# EAGLE design piglow (EAGLE 6.4)
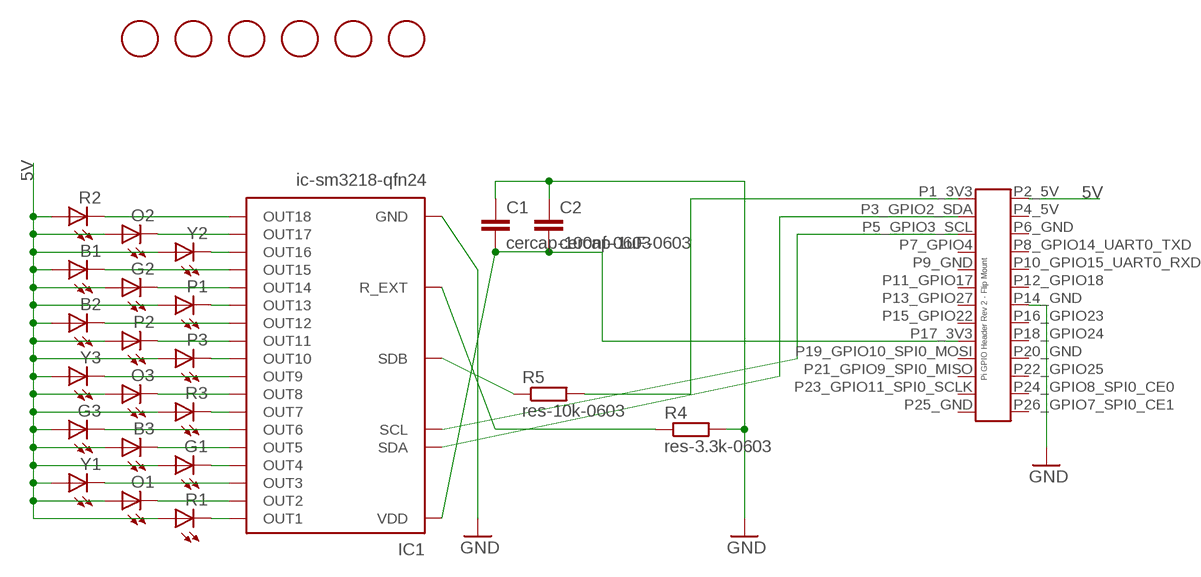
[diagram p0: schematic, sheet 1]

## Parts
B1  led-blue-0805  LEDCHIPLED_0805  [CHIPLED_0805]
B2  led-blue-0805  LEDCHIPLED_0805  [CHIPLED_0805]
B3  led-blue-0805  LEDCHIPLED_0805  [CHIPLED_0805]
C1  cercap-100nf-0603  C-EUC0603K  [C0603K]
C2  cercap-1uF-0603  C-EUC0603K  [C0603K]
G1  led-green-0805  LEDCHIPLED_0805  [CHIPLED_0805]
G2  led-green-0805  LEDCHIPLED_0805  [CHIPLED_0805]
G3  led-green-0805  LEDCHIPLED_0805  [CHIPLED_0805]
IC1  ic-sm3218-qfn24  SN3218  [QFN24]
O1  led-orange-0805  LEDCHIPLED_0805  [CHIPLED_0805]
O2  led-orange-0805  LEDCHIPLED_0805  [CHIPLED_0805]
O3  led-orange-0805  LEDCHIPLED_0805  [CHIPLED_0805]
P1  led-pink-0805  LEDCHIPLED_0805  [CHIPLED_0805]
P2  led-pink-0805  LEDCHIPLED_0805  [CHIPLED_0805]
P3  led-pink-0805  LEDCHIPLED_0805  [CHIPLED_0805]
R1  led-red-0805  LEDCHIPLED_0805  [CHIPLED_0805]
R2  led-red-0805  LEDCHIPLED_0805  [CHIPLED_0805]
R3  led-red-0805  LEDCHIPLED_0805  [CHIPLED_0805]
R4  res-3.3k-0603  R-EU_R0603  [R0603]
R5  res-10k-0603  R-EU_R0603  [R0603@1]
U$1  FIDUCIAL  [FIDUCIAL_1MM]
U$2  FIDUCIAL  [FIDUCIAL_1MM]
U$3  FIDUCIAL  [FIDUCIAL_1MM]
U$4  FCI_89898_313LF_26P_CONNECTOR_SMT_FLIPPED  [FCI_89898_313LF_26P_CONNECTOR_SMT_FLIPPED]
U$5  FIDUCIAL  [FIDUCIAL_1MM]
U$6  FIDUCIAL  [FIDUCIAL_1MM]
U$7  FIDUCIAL  [FIDUCIAL_1MM]
Y1  led-yellow-0805  LEDCHIPLED_0805  [CHIPLED_0805]
Y2  led-yellow-0805  LEDCHIPLED_0805  [CHIPLED_0805]
Y3  led-yellow-0805  LEDCHIPLED_0805  [CHIPLED_0805]

## Nets
5V: B1.A B2.A B3.A G1.A G2.A G3.A O1.A O2.A O3.A P1.A P2.A P3.A R1.A R2.A R3.A U$4.P2_5V Y1.A Y2.A Y3.A
GND: C1.1 C2.1 IC1.4(GND) IC1.GND R4.2 U$4.P14_GND
N$1: IC1.6(SCL) U$4.P5_GPIO3_SCL
N$2: IC1.5(SDA) U$4.P3_GPIO2_SDA
N$3: IC1.24(SDB) R5.1
N$4: IC1.1(OUT18) R2.C
N$5: IC1.23(OUT17) O2.C
N$6: IC1.22(OUT16) Y2.C
N$7: B1.C IC1.21(OUT15)
N$8: IC1.7(OUT1) R1.C
N$9: IC1.8(OUT2) O1.C
N$10: IC1.9(OUT3) Y1.C
N$11: G1.C IC1.10(OUT4)
N$12: B3.C IC1.11(OUT5)
N$13: G3.C IC1.12(OUT6)
N$14: IC1.13(OUT7) R3.C
N$15: IC1.14(OUT8) O3.C
N$16: IC1.15(OUT9) Y3.C
N$17: IC1.16(OUT10) P3.C
N$18: IC1.17(OUT11) P2.C
N$19: IC1.2(R_EXT) R4.1
N$20: IC1.19(OUT13) P1.C
N$21: B2.C IC1.18(OUT12)
N$22: G2.C IC1.20(OUT14)
N$23: C1.2 C2.2 IC1.3(VDD) U$4.P17_3V3
VCC: R5.2 U$4.P1_3V3
Unconnected: U$4.P6_GND U$4.P7_GPIO4 U$4.P8_GPIO14_UART0_TXD U$4.P9_GND U$4.P10_GPIO15_UART0_RXD U$4.P11_GPIO17 U$4.P12_GPIO18 U$4.P13_GPIO27 U$4.P15_GPIO22 U$4.P16_GPIO23 U$4.P18_GPIO24 U$4.P19_GPIO10_SPI0_MOSI U$4.P20_GND U$4.P21_GPIO9_SPI0_MISO U$4.P22_GPIO25 U$4.P23_GPIO11_SPI0_SCLK U$4.P24_GPIO8_SPI0_CE0 U$4.P25_GND U$4.P26_GPIO7_SPI0_CE1

## Power pins joined to a net without a drawn wire
P4_5V: U$4.P4_5V

## Library data of the parts
B1-B3 G1-G3 O1-O3 P1-P3 R1-R3 Y1-Y3 = adafruit:LED: LED OSRAM: - CHIPLED LG R971, LG N971, LY N971, LG Q971, LY Q971, LO R971, LY R971 LH N974, LH R974 LS Q976, LO Q976, LY Q976 LO Q996 - Hyper CHIPLED LW Q18S LB Q993, LB Q99A, LB R99A - SideLED LS A670, LO A670, LY A670, LG A670, LP A670 LB A673, LV A673, LT A673, LW A673 LH A674 LY A675 LS A676, LA A676, LO A676, LY A676, LW A676 LS A679, LY A679, LG A679 - Hyper Micro SIDELED® LS Y876, LA Y876, LO Y876, LY Y876 LT Y87S - SmartLED LW L88C, LW L88S LB L89C, LB L89S, LG L890 LS L89K, LO L89K, LY L89K LS L896, LA L896, LO L896, LY L896 - TOPLED LS T670, LO T670, LY T670, LG T670, LP T670 LSG T670, LSP T670, LSY T670, LOP T670, LYG T670 LG T671, LOG T671, LSG T671 LB T673, LV T673, LT T673, LW T673 LH T674 LS T676, LA T676, LO T676, LY T676, LB T676, LH T676, LSB T676, LW T676 LB T67C, LV T67C, LT T67C, LS T67K, LO T67K, LY T67K, LW E67C LS E67B, LA E67B, LO E67B, LY E67B, LB E67C, LV E67C, LT E67C LW T67C LS T679, LY T679, LG T679 LS T770, LO T770, LY T770, LG T770, LP T770 LB T773, LV T773, LT T773, LW T773 LH T774 LS E675, LA E675, LY E675, LS T675 LS T776, LA T776, LO T776, LY T776, LB T776 LHGB T686 LT T68C, LB T68C - Hyper Mini TOPLED® LB M676 - Mini TOPLED Santana® LG M470 LS M47K, LO M47K, LY M47K Source: http://www.osram.convergy.de/
C1 C2 = resistor:C-EU: CAPACITOR, European symbol
IC1 = pimoroni:SN3218: SN3218 16-channel LED driver
R4 = rcl:R-EU_: RESISTOR, European symbol
R5 = resistor:R-EU_: RESISTOR, European symbol
U$1-U$3 U$5-U$7 = adafruit:FIDUCIAL: For use by pick and place machines to calibrate the vision/machine, 1mm By microbuilder.eu
U$4 = pimoroni:FCI_89898_313LF_26P_CONNECTOR_SMT_FLIPPED

## Board
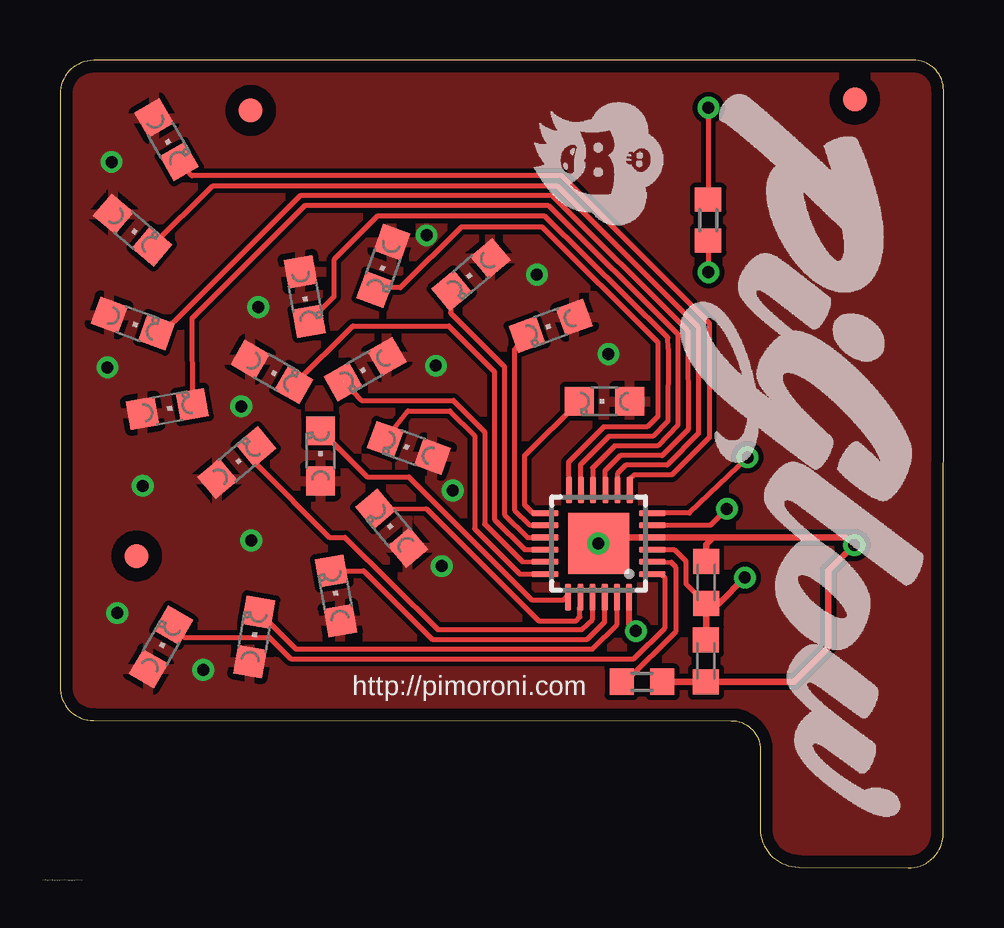
[diagram p1: board, top side]
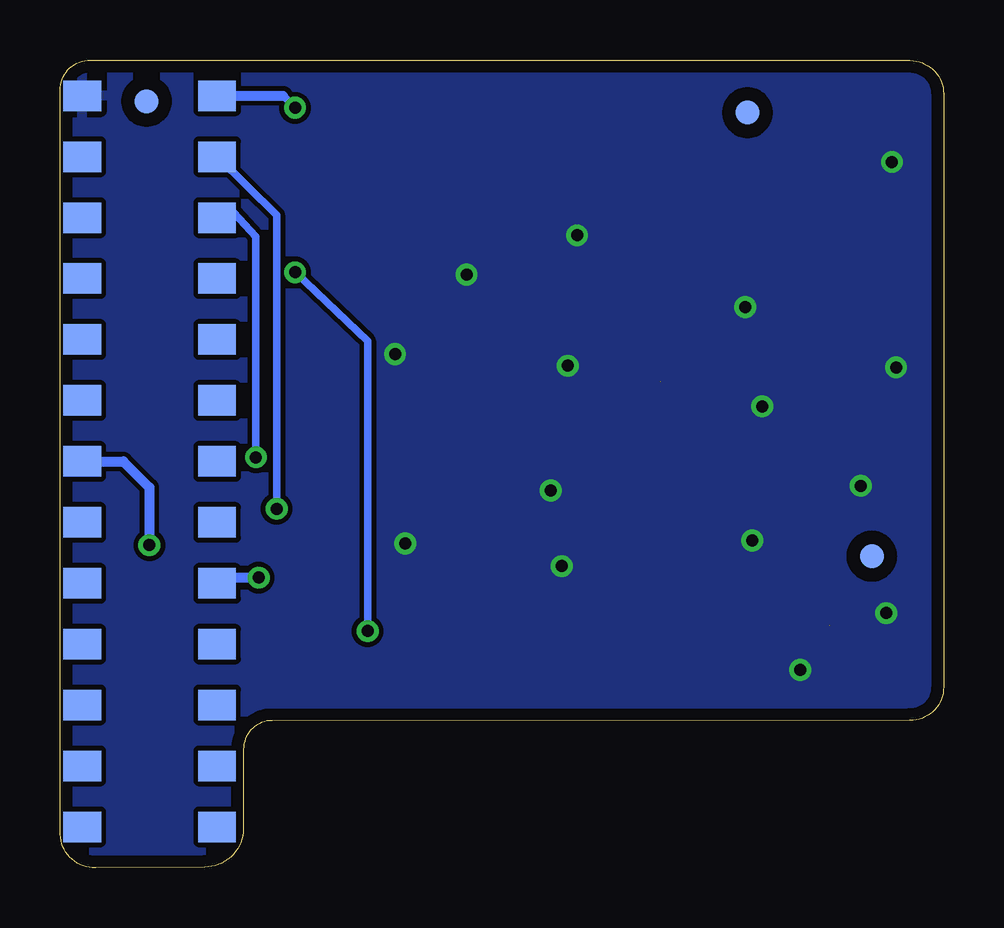
[diagram p2: board, bottom side, seen from below]

Size 36.82 x 33.68 mm. Coordinates in mm from the lower left corner, seen from the top.
Outline: 0,32.26 0,7.54 arc90 1.4,6.14 27.97,6.14 arc-90 29.17,4.94 29.17,1.63 arc90 30.79,0.03 35.33,0 arc90 36.8,1.4 36.82,32.41 arc90 35.54,33.68 1.4,33.66 arc90 0,32.26
Copper layers (1*16): Top 0.035mm / dielectric 1.5mm / Bottom 0.035mm
Design rules "default *": minimum track width 10mil, minimum drill 24mil, track to track 8mil, track to pad 8mil, pad to pad 8mil, via to via 8mil, smd to smd 8mil, copper to edge 20mil, drill to drill 8mil, minimum pad ring 10mil, minimum via ring 8mil, stop-mask expansion 4mil, vias tented up to drill 25mil, thermal gap 10mil

### Footprints (pad centres in the part's own frame; a part is rotated, then mirrored left to right if it is on the bottom)
CHIPLED_0805 = smd 1.2 x 1.2: A 0,-1.05; C 0,1.05
C0603K = smd 1.05 x 1.08: 1 -0.875,0; 2 0.875,0
QFN24 = smd 1.108 x 0.254: 1 -2.235,1.27; 2 -2.235,0.762; 3 -2.235,0.254; 4 -2.235,-0.254; 5 -2.235,-0.762; 6 -2.235,-1.27; 13 2.235,-1.27; 14 2.235,-0.762; 15 2.235,-0.254; 16 2.235,0.254; 17 2.235,0.762; 18 2.235,1.27 | smd 0.254 x 1.108: 7 -1.295,-2.235; 8 -0.787,-2.235; 9 -0.279,-2.235; 10 0.229,-2.235; 11 0.737,-2.235; 12 1.245,-2.235; 19 1.27,2.235; 20 0.762,2.235; 21 0.254,2.235; 22 -0.254,2.235; 23 -0.762,2.235; 24 -1.27,2.235 | smd 2.54 x 2.54: GND 0,0
R0603 = smd 1 x 1.1: 1 -0.85,0; 2 0.85,0
FIDUCIAL_1MM = smd 1 x 1: 1 0,0
FCI_89898_313LF_26P_CONNECTOR_SMT_FLIPPED = smd 1.27 x 1.57: P1_3V3 15.24,-2.81; P2_5V 15.24,2.81; P3_GPIO2_SDA 12.7,-2.81; P4_5V 12.7,2.81; P5_GPIO3_SCL 10.16,-2.81; P6_GND 10.16,2.81; P7_GPIO4 7.62,-2.81; P8_GPIO14_UART0_TXD 7.62,2.81; P9_GND 5.08,-2.81; P10_GPIO15_UART0_RXD 5.08,2.81; P11_GPIO17 2.54,-2.81; P12_GPIO18 2.54,2.81; P13_GPIO27 0,-2.81; P14_GND 0,2.81; P15_GPIO22 -2.54,-2.81; P16_GPIO23 -2.54,2.81; P17_3V3 -5.08,-2.81; P18_GPIO24 -5.08,2.81; P19_GPIO10_SPI0_MOSI -7.62,-2.81; P20_GND -7.62,2.81; P21_GPIO9_SPI0_MISO -10.16,-2.81; P22_GPIO25 -10.16,2.81; P23_GPIO11_SPI0_SCLK -12.7,-2.81; P24_GPIO8_SPI0_CE0 -12.7,2.81; P25_GND -15.24,-2.81; P26_GPIO7_SPI0_CE1 -15.24,2.81

### Placement (x,y rotation side)
B1  7.36,16.89 310 top
B2  14.53,17.51 70 top
B3  10.2,23.82 190 top
C1  26.91,8.63 90 top
C2  26.93,11.9 270 top
G1  4.48,19.13 280 top
G2  13.82,14.16 40 top
G3  13.47,25.09 160 top
IC1  22.44,13.52 180 top
O1  3.02,26.59 230 top
O2  8.09,9.63 350 top
O3  20.44,22.59 110 top
P1  10.86,17.17 0 top
P2  12.71,20.79 120 top
P3  8.83,20.67 240 top
R1  4.44,30.35 210 top
R2  4.21,9.2 330 top
R3  22.69,19.45 90 top
R4  24.25,7.76 0 top
R5  res-10k-0603  [R0603]  27.01,27 90 top
U$1  3.2,13 0 top
U$2  33.21,31.96 0 bottom
U$3  7.95,31.57 0 top
U$4  33.08,16.95 90 bottom
U$5  8.17,31.48 0 bottom
U$6  2.99,12.99 0 bottom
U$7  33.12,32.04 0 top
Y1  3.03,22.69 250 top
Y2  11.5,11.34 10 top
Y3  17.13,24.74 130 top

### Tracks (layer width: path | path; a pad name or v marks a point on that pad's centre or on a via)
5V  (via drill 0.5)
  other vias: 22.85,21.42 8.26,23.38 1.98,20.86 2.39,10.62 3.45,15.93 7.97,13.64 16.37,15.73 19.87,24.73 15.27,26.37 15.66,20.93 2.15,29.43 15.91,12.58 7.55,19.24 5.97,8.25 22.43,13.53
  pour Top: 0.2,33.62 0.17,6.23 28.79,5.9 29.16,0.29 36.98,0.2 36.9,33.79
  pour Bottom: 0.17,33.48 0.22,6.28 28.8,6.01 29.18,0.37 37.03,0.12 36.87,33.78 0.63,33.56
GND  (via drill 0.5)
  Top 0.203: 22.7,13.77 arc90 IC1.GND
  Top 0.279: R4.2 C1.1 30.57,7.75 32.01,9.19 32.01,12.39 v33.09,13.45 32.74,13.77 27.22,13.77 | 27.22,13.77 IC1.4 22.7,13.77 | C2.1 26.93,13.48 27.22,13.77
  Bottom 0.406: U$4.P14_GND 34.18,16.94 33.09,15.86 33.09,14.41 v33.09,13.45
N$1  (via drill 0.5)
  Top 0.203: v28.65,17.12 26.22,14.79 IC1.6
  Bottom 0.305: U$4.P5_GPIO3_SCL 29.58,27.31 28.65,26.32 v28.65,17.12
N$2  (via drill 0.5)
  Top 0.203: v27.79,14.97 27.1,14.28 IC1.5
  Bottom 0.305: U$4.P3_GPIO2_SDA 27.79,27.22 v27.79,14.97
N$3  (via drill 0.5)
  Top 0.203: R5.1 v27.02,24.83
  Top 0.254: v24,9.87 23.72,10.15 IC1.24
  Bottom 0.305: v27.02,24.83 24,21.96 v24,9.87
N$4  (1 unrouted)
  Top 0.203: R2.C 5.15,9.61 8.72,9.61 9.62,8.71 23.91,8.71 25.22,10.01 25.22,12.07 25.01,12.24 IC1.1
N$5
  Top 0.203: O2.C 9.82,9.12 22.18,9.12 23.21,10.15 IC1.23
N$6
  Top 0.203: Y2.C 12.66,12.38 15.5,9.53 21.96,9.53 22.69,10.25 IC1.22
N$7
  Top 0.203: B1.C 8.19,16.83 11.22,13.78 11.87,13.78 15.73,9.93 21.75,9.93 22.19,10.36 IC1.21
N$8
  Top 0.203: R1.C 5.5,28.85 20.9,28.85 27.06,22.7 27.06,17.93 25.5,16.38 23.93,16.38 23.72,16.19 IC1.7
N$9
  Top 0.203: O1.C 6.37,28.44 20.71,28.44 26.6,22.54 26.6,18.1 25.29,16.79 23.58,16.79 23.22,16.43 IC1.8
N$10
  Top 0.203: Y1.C 4.76,22.77 10,28.02 20.52,28.02 26.16,22.39 26.17,18.26 25.09,17.18 23.35,17.18 22.7,16.55 IC1.9
N$11
  Top 0.203: G1.C 5.5,22.91 10.19,27.6 20.36,27.6 25.75,22.25 25.75,18.47 24.9,17.59 23.11,17.59 22.19,16.68 IC1.10
N$12
  Top 0.203: B3.C 11.41,23.81 11.41,25.35 13.22,27.17 20.21,27.17 25.33,22.1 25.33,21.66 25.33,18.62 24.7,17.98 22.87,17.98 21.69,16.8 IC1.11
N$13
  Top 0.203: G3.C 13.14,24.18 14.18,24.18 16.73,26.72 20.08,26.72 24.92,21.91 24.91,18.82 24.47,18.38 22.65,18.38 21.18,16.9 IC1.12
N$14
  Top 0.203: R3.C 19.35,17.17 19.35,15.14 19.7,14.8 20.2,14.78 IC1.13
N$15
  Top 0.203: O3.C 18.93,21.62 18.93,14.92 19.58,14.29 IC1.14
N$16
  Top 0.203: Y3.C 16.28,23.13 18.51,20.89 18.51,14.73 19.49,13.77 IC1.15
N$17
  Top 0.203: P3.C 12.2,22.59 16.2,22.59 18.1,20.69 18.1,14.53 19.36,13.27 IC1.16
N$18  (1 unrouted)
  Top 0.203: P2.C 12.55,19.48 16.39,19.48 17.7,18.17 17.7,14.33 19.26,12.76 IC1.17
N$19
  Top 0.203: IC1.2 25.47,12.74 25.65,12.54 25.65,9.84 23.59,7.79 23.49,7.86 R4.1
N$20
  Top 0.203: P1.C 12.8,16.29 14.54,16.29 19.65,11.18 21,11.18 21.18,11.37 IC1.19
N$21
  Top 0.203: B2.C 14.5,19.05 16.25,19.05 17.28,18.02 17.28,14.14 19.16,12.24 IC1.18
N$22
  Top 0.203: G2.C 15.26,14.97 19.95,10.3 21.52,10.3 21.66,10.45 IC1.20
N$23  (via drill 0.5)
  Top 0.203: IC1.3 25.58,13.27 26.08,12.79 26.08,11.85 C2.2 | C1.2 arc90 26.93,9.52
  Top 0.279: 26.93,9.52 C2.2 27.46,11.02 v28.54,12.1
  Bottom 0.406: U$4.P17_3V3 30.29,12.1 v28.54,12.1
VCC  (via drill 0.5)
  Top 0.203: v27.02,31.69 27.02,27.86 R5.2
  Bottom 0.305: 27.52,32.18 v27.02,31.69
  Bottom 0.406: 27.52,32.18 U$4.P1_3V3 30.32,32.37

### Text on the board
tPlace: http://pimoroni.com | E:/Dropbox/Eagle/projects/PiGlow/piglow1200.bmp